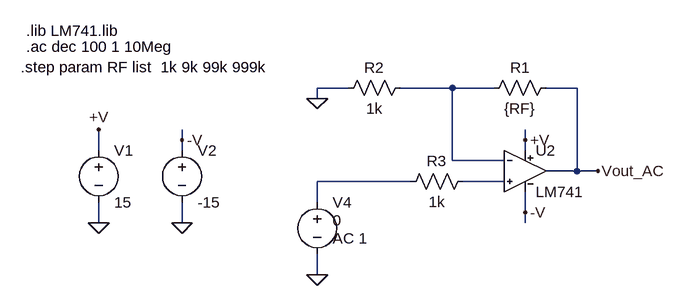
[diagram p0: schematic GBW_neinversor.asc]
GBW_neinversor.asc, the LTspice schematic file:
Version 4
SHEET 1 964 916
WIRE -368 288 -416 288
WIRE -208 288 -288 288
WIRE -144 288 -208 288
WIRE -16 288 -64 288
WIRE -416 304 -416 288
WIRE -624 368 -624 352
WIRE -96 368 -96 352
WIRE -752 384 -752 352
WIRE -624 384 -624 368
WIRE -96 384 -96 368
WIRE -208 400 -208 288
WIRE -128 400 -208 400
WIRE -16 416 -16 288
WIRE -16 416 -64 416
WIRE 16 416 -16 416
WIRE -272 432 -416 432
WIRE -128 432 -192 432
WIRE -416 464 -416 432
WIRE -96 480 -96 448
WIRE -752 496 -752 464
WIRE -624 496 -624 464
WIRE -96 496 -96 480
WIRE -416 576 -416 544
FLAG -752 496 0
FLAG -624 496 0
FLAG 16 416 Vout_AC
FLAG -416 576 0
FLAG -416 304 0
FLAG -752 352 +V
FLAG -96 368 +V
FLAG -624 368 -V
FLAG -96 480 -V
SYMBOL voltage -752 368 R0
WINDOW 123 0 0 Left 2
WINDOW 39 0 0 Left 2
SYMATTR InstName V1
SYMATTR Value 15
SYMBOL voltage -624 368 R0
WINDOW 123 0 0 Left 2
WINDOW 39 0 0 Left 2
SYMATTR InstName V2
SYMATTR Value -15
SYMBOL LM741 -96 352 R0
SYMATTR InstName U2
SYMBOL voltage -416 448 R0
WINDOW 3 24 44 Left 2
WINDOW 123 24 72 Left 2
WINDOW 39 0 0 Left 2
SYMATTR Value 0
SYMATTR Value2 AC 1
SYMATTR InstName V4
SYMBOL res -48 272 R90
WINDOW 0 0 56 VBottom 2
WINDOW 3 32 56 VTop 2
SYMATTR InstName R1
SYMATTR Value {RF}
SYMBOL res -272 272 R90
WINDOW 0 0 56 VBottom 2
WINDOW 3 32 56 VTop 2
SYMATTR InstName R2
SYMATTR Value 1k
SYMBOL res -176 416 R90
WINDOW 0 0 56 VBottom 2
WINDOW 3 32 56 VTop 2
SYMATTR InstName R3
SYMATTR Value 1k
TEXT -864 200 Left 2 !.lib LM741.lib
TEXT -864 224 Left 2 !.ac dec 100 1 10Meg
TEXT -872 256 Left 2 !.step param RF list  1k 9k 99k 999k

The netlist it stands for:
* GBW_neinversor.asc
V1 +V 0 15
V2 -V 0 -15
XU2 N003 N001 +V -V Vout_AC LM741  ; pins In+ In- V+ V- OUT
V4 N002 0 0 AC 1
R1 Vout_AC N001 {RF}
R2 N001 0 1k
R3 N003 N002 1k
.lib LM741.lib
.ac dec 100 1 10Meg
.step param RF list  1k 9k 99k 999k
.lib LM741.lib
.backanno
.end